# Altium schematic sheet E1.SchDoc: Перестраиваемый генератор
size 840 x 594 mm; CheckedBy: Семенцов С. Г.; Author: Наумов И. К.; Address1: Address1; Address2: Address2; Address3: Address3; Address4: Address4; DocumentNumber: ИУ4.11.03.03.24.05.52.15.001 Э1; SheetNumber: 2; SheetTotal: 4; Title2str: прямоугольных импульсов; DocumentType: Схема электрическая структурная; FirstReferrence: ИУ4.11.03.03.24.05.52.15.001
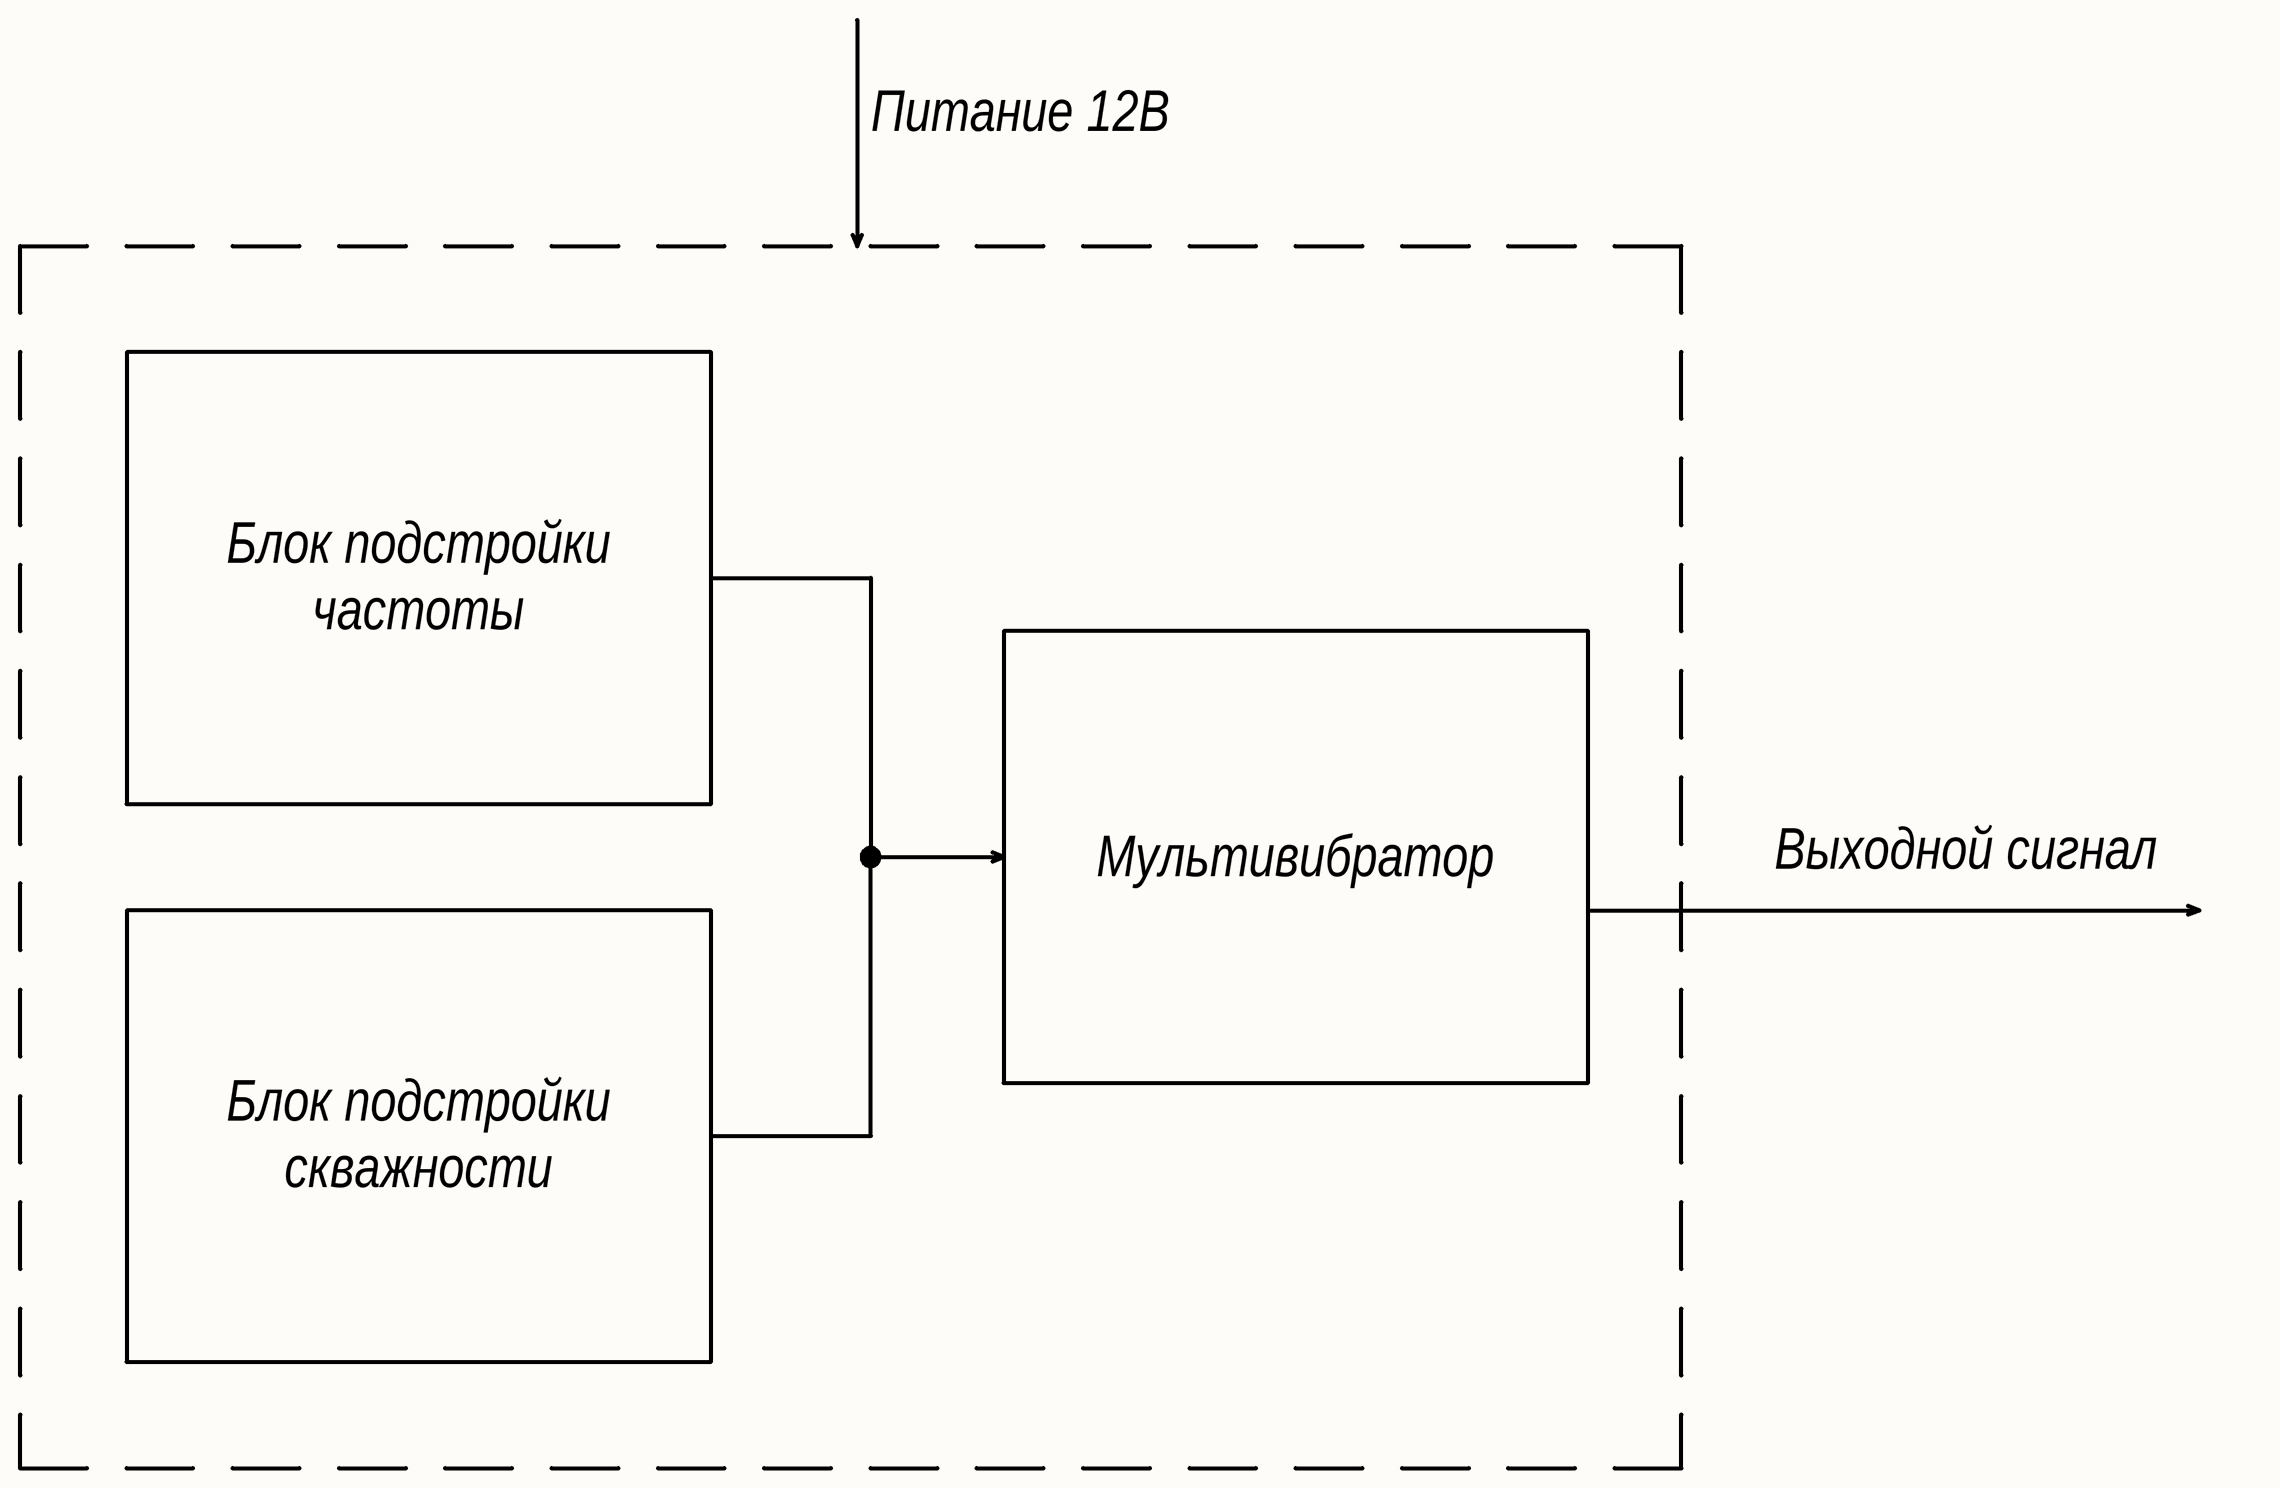
[diagram p0: E1.SchDoc]

## Notes on the sheet
- Питание 12В
- Блок подстройки
- частоты
- Мультивибратор
- Выходной сигнал
- скважности
- Перв. примен.
- Справ. №
- Подп. и дата
- Инв. № дубл.
- Взам. инв. №
- Разраб.
- Изм.
- Лист
- № докум.
- Подп.
- Дата
- Лит.
- Масса
- Масштаб
- Пров.
- Т.контр.
- Листов
- 1
- Инв. № подл.
- Утв.
- Н.контр.
- МГТУ им. Н. Э. Баумана
- Кафедра ИУ4
- Группа ИУ4-52Б
- Копировал
- Формат А1